# EAGLE schematic DasAltimeter square v0.1 (EAGLE 8.6.0)
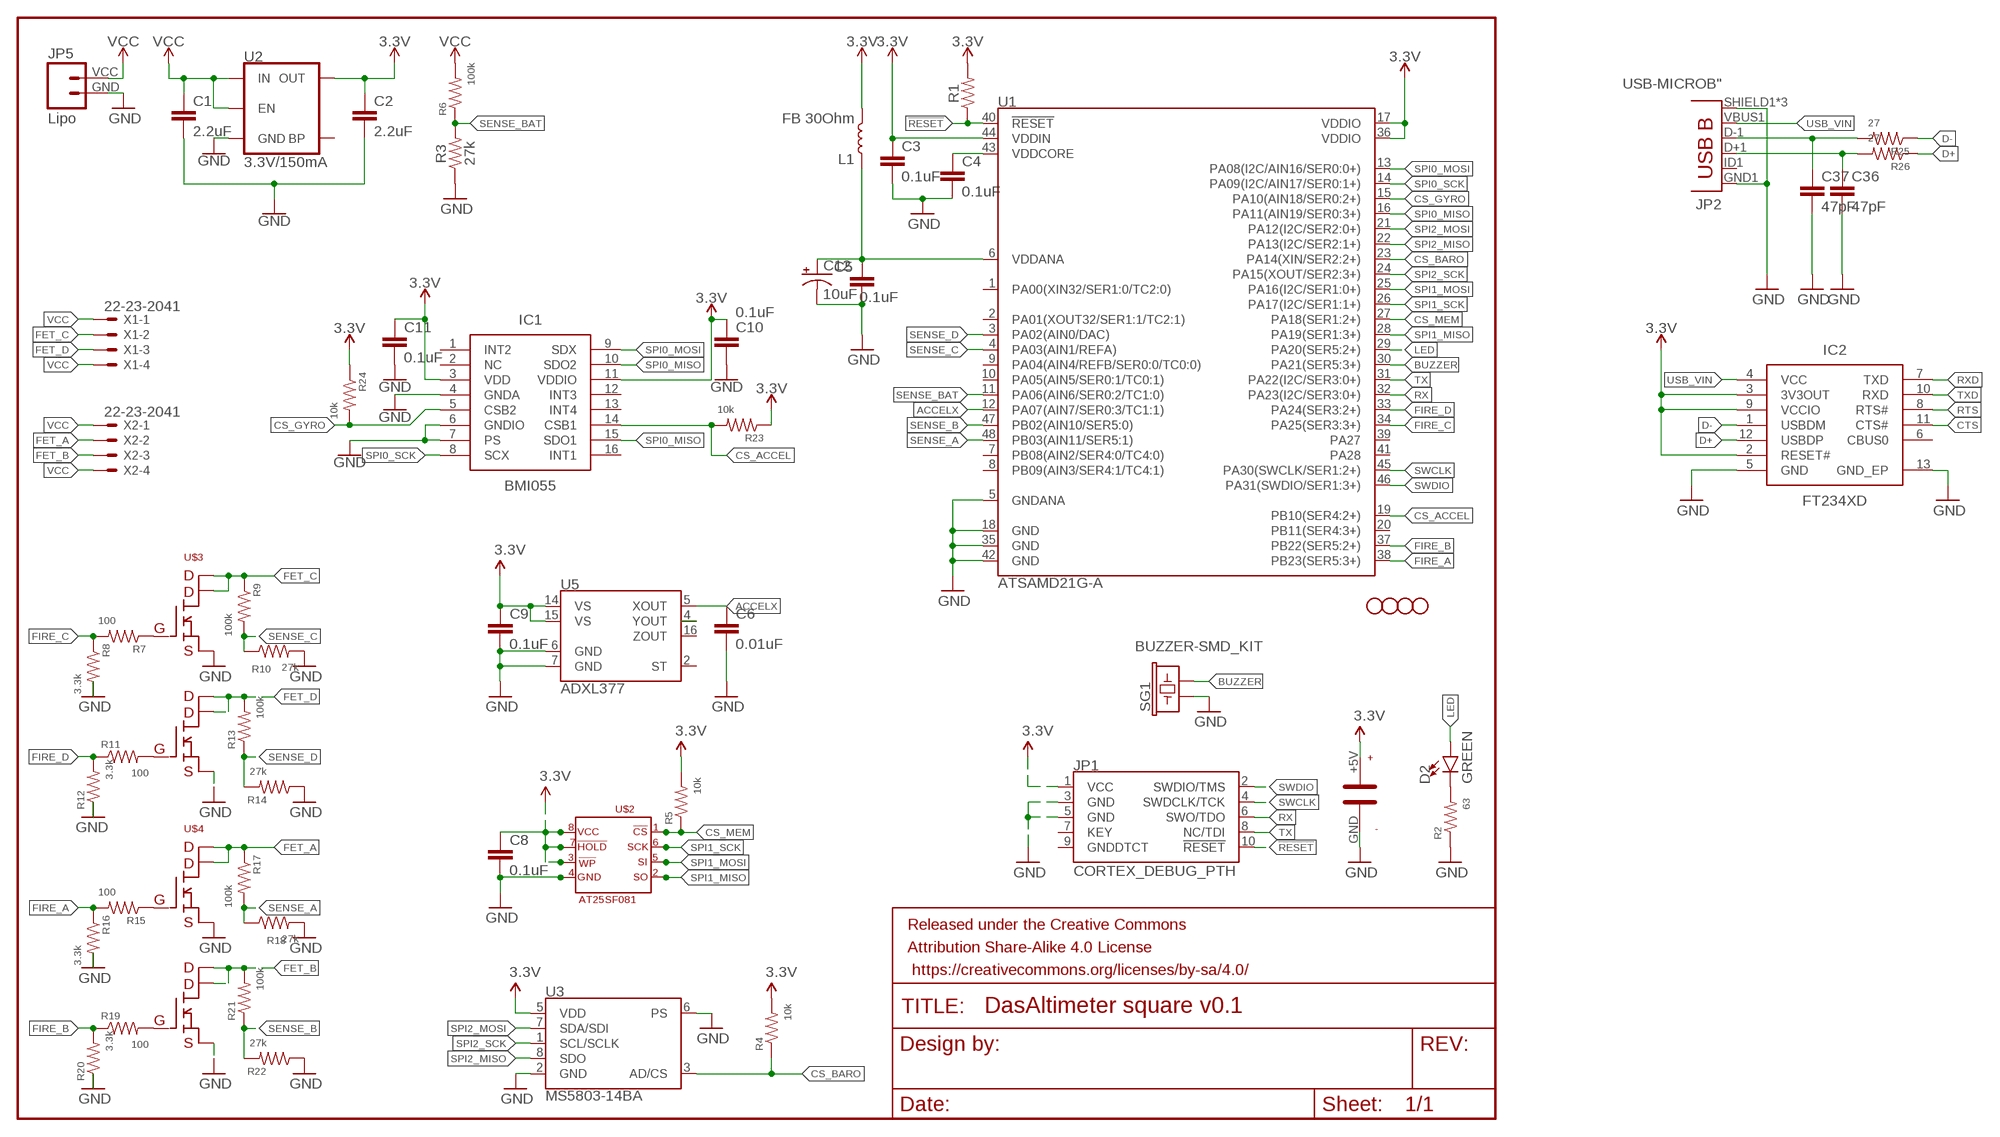
[diagram p0: schematic, sheet 1]

## Parts
C1  2.2uF  2.2UF-0603-10V-20%  [0603]
C2  2.2uF  2.2UF-0603-10V-20%  [0603]
C3  0.1uF  0.1UF-0402-16V-10%  [0402]
C4  0.1uF  0.1UF-0402-16V-10%  [0402]
C5  0.1uF  0.1UF-0402-16V-10%  [0402]
C6  0.01uF  0.1UF-0402-16V-10%  [0402]
C8  0.1uF  0.1UF-0402-16V-10%  [0402]
C9  0.1uF  0.1UF-0402-16V-10%  [0402]
C10  0.1uF  0.1UF-0402-16V-10%  [0402]
C11  0.1uF  0.1UF-0402-16V-10%  [0402]
C12  10uF  10UF-POLAR-0603-6.3V-20%(TANT)  [0603-POLAR]
C36  47pF  0.1UF-0402-16V-10%  [0402]
C37  47pF  0.1UF-0402-16V-10%  [0402]
D2  GREEN  LED-GREEN1206  [LED-1206]
FRAME1  FRAME-LETTERNO_PACKAGE  [DUMMY]
H1  STAND-OFFTIGHT  [STAND-OFF-TIGHT]
H2  STAND-OFFTIGHT  [STAND-OFF-TIGHT]
H3  STAND-OFFTIGHT  [STAND-OFF-TIGHT]
H4  STAND-OFFTIGHT  [STAND-OFF-TIGHT]
IC1  BMI055  [BMI055]
IC2  FT234XD  [SON45P300X300X80-13N]
JP1  CORTEX_DEBUG_PTH  [2X5-PTH-1.27MM]
JP2  USB-MICROB"  [USB-B-MICRO-SMD_V03]
JP5  Lipo  M024UCON-15767  [JST-2-SMD-VERT]
L1  FB 30Ohm  INDUCTOR-0603-33NH  [0603]
R1  RESISTOR0402  [0402]
R2  63  RESISTOR0402  [0402]
R3  27k  RESISTOR0402  [0402]
R4  10k  RESISTOR0402  [0402]
R5  10k  RESISTOR0402  [0402]
R6  100k  RESISTOR0402  [0402]
R7  100  RESISTOR0402  [0402]
R8  3.3k  RESISTOR0402  [0402]
R9  100k  RESISTOR0402  [0402]
R10  27k  RESISTOR0402  [0402]
R11  100  RESISTOR0402  [0402]
R12  3.3k  RESISTOR0402  [0402]
R13  100k  RESISTOR0402  [0402]
R14  27k  RESISTOR0402  [0402]
R15  100  RESISTOR0402  [0402]
R16  3.3k  RESISTOR0402  [0402]
R17  100k  RESISTOR0402  [0402]
R18  27k  RESISTOR0402  [0402]
R19  100  RESISTOR0402  [0402]
R20  3.3k  RESISTOR0402  [0402]
R21  100k  RESISTOR0402  [0402]
R22  27k  RESISTOR0402  [0402]
R23  10k  RESISTOR0402  [0402]
R24  10k  RESISTOR0402  [0402]
R25  27  RESISTOR0402  [0402]
R26  27  RESISTOR0402  [0402]
SG1  BUZZER-SMD_KIT  [BUZZER-CCV-KIT]
U1  ATSAMD21G-A  [TQFP-48]
U2  3.3V/150mA  V_REG_MIC52053.3V  [SOT23-5]
U3  MS5803-14BA  [MS5803]
U5  ADXL377  [LFCSP-16-3X3]
U$1  PB-5R0H104-R  [PB-5R0H104-R]
U$2  AT25SF081  [AT25SF081]
U$3  SI7232DN  [SI7232DN]
U$4  SI7232DN  [SI7232DN]
X1  22-23-2041  [22-23-2041]
X2  22-23-2041  [22-23-2041]

## Nets
3.3V: C2.1 C3.1 C8.1 C9.1 C10.1 C11.1 IC1.3(VDD) IC1.11(VDDIO) IC2.2(RESET#) IC2.3(3V3OUT) IC2.9(VCCIO) JP1.1(VCC) L1.2 R1.2 R4.2 R5.2 R23.1 R24.1 U1.17(VDDIO) U1.36(VDDIO) U1.44(VDDIN) U2.5(OUT) U3.5(VDD) U5.14(VS) U5.15(VS) U$1.+5V U$2.!HOLD U$2.!WP U$2.VCC
!RESET: JP1.10(!RESET) R1.1 U1.40(!RESET!)
ACCELX: C6.1 U1.12(PA07(AIN7/SER0:3/TC1:1)) U5.5(XOUT)
BUZZER: SG1.- U1.30(PA21(SER5:3+))
CS_ACCEL: IC1.14(CSB1) R23.2 U1.19(PB10(SER4:2+))
CS_BARO: R4.1 U1.23(PA14(XIN/SER2:2+)) U3.3(AD/CS)
CS_GYRO: IC1.5(CSB2) R24.2 U1.15(PA10(AIN18/SER0:2+))
CS_MEM: R5.1 U1.27(PA18(SER1:2+)) U$2.!CS
CTS: IC2.11(CTS#)
D+: IC2.12(USBDP) R26.1
D-: IC2.1(USBDM) R25.1
FET_A: R17.1 U$4.7(PIN7) U$4.8(PIN8) U$4.9(PIN8) X2.2
FET_B: R21.2 U$4.5(PIN5) U$4.6(PIN6) U$4.10(PIN5) X2.3
FET_C: R9.1 U$3.7(PIN7) U$3.8(PIN8) U$3.9(PIN8) X1.2
FET_D: R13.2 U$3.5(PIN5) U$3.6(PIN6) U$3.10(PIN5) X1.3
FIRE_A: R15.2 R16.1 U1.38(PB23(SER5:3+))
FIRE_B: R19.1 R20.2 U1.37(PB22(SER5:2+))
FIRE_C: R7.2 R8.1 U1.34(PA25(SER3:3+))
FIRE_D: R11.1 R12.2 U1.33(PA24(SER3:2+))
GND: C1.2 C2.2 C3.2 C4.2 C5.2 C6.2 C8.2 C9.2 C10.2 C11.2 C12.- C36.2 C37.2 IC1.4(GNDA) IC1.6(GNDIO) IC1.7(PS) IC2.5(GND) IC2.13(GND_EP) JP1.3(GND) JP1.5(GND) JP2.GND1(GND) JP2.SHIELD1(SHIELD) JP2.SHIELD2(SHIELD) JP2.SHIELD3(SHIELD) JP5.GND R2.1 R3.1 R8.2 R10.2 R12.1 R14.1 R16.2 R18.2 R20.1 R22.1 SG1.+ U1.5(GNDANA) U1.18(GND) U1.35(GND) U1.42(GND) U2.2(GND) U3.2(GND) U3.6(PS) U5.6(GND) U5.7(GND) U$1.GND U$2.GND U$3.1(PIN1) U$3.3(PIN3) U$4.1(PIN1) U$4.3(PIN3)
LED: D2.A U1.29(PA20(SER5:2+))
N$1: R7.1 U$3.2(PIN2)
N$2: U5.4(YOUT)
N$3: C4.1 U1.43(VDDCORE)
N$4: C5.1 C12.+ L1.1 U1.6(VDDANA)
N$5: C36.1 JP2.D+1(D+) R26.2
N$8: R11.2 U$3.4(PIN4)
N$12: R15.1 U$4.2(PIN2)
N$13: R19.2 U$4.4(PIN4)
N$17: C37.1 JP2.D-1(D-) R25.2
N$29: D2.C R2.2
RTS: IC2.8(RTS#)
RX: JP1.6(SWO/TDO) U1.32(PA23(I2C/SER3:0+))
RXD: IC2.7(TXD)
SENSE_A: R17.2 R18.1 U1.48(PB03(AIN11/SER5:1))
SENSE_B: R21.1 R22.2 U1.47(PB02(AIN10/SER5:0))
SENSE_BAT: R3.2 R6.1 U1.11(PA06(AIN6/SER0:2/TC1:0))
SENSE_C: R9.2 R10.1 U1.4(PA03(AIN1/REFA))
SENSE_D: R13.1 R14.2 U1.3(PA02(AIN0/DAC))
SPI0_MISO: IC1.10(SDO2) IC1.15(SDO1) U1.16(PA11(AIN19/SER0:3+))
SPI0_MOSI: IC1.9(SDX) U1.13(PA08(I2C/AIN16/SER0:0+))
SPI0_SCK: IC1.8(SCX) U1.14(PA09(I2C/AIN17/SER0:1+))
SPI1_MISO: U1.28(PA19(SER1:3+)) U$2.SO
SPI1_MOSI: U1.25(PA16(I2C/SER1:0+)) U$2.SI
SPI1_SCK: U1.26(PA17(I2C/SER1:1+)) U$2.SCK
SPI2_MISO: U1.22(PA13(I2C/SER2:1+)) U3.8(SDO)
SPI2_MOSI: U1.21(PA12(I2C/SER2:0+)) U3.7(SDA/SDI)
SPI2_SCK: U1.24(PA15(XOUT/SER2:3+)) U3.1(SCL/SCLK)
SWCLK: JP1.4(SWDCLK/TCK) U1.45(PA30(SWCLK/SER1:2+))
SWDIO: JP1.2(SWDIO/TMS) U1.46(PA31(SWDIO/SER1:3+))
TX: JP1.8(NC/TDI) U1.31(PA22(I2C/SER3:0+))
TXD: IC2.10(RXD)
USB_VIN: IC2.4(VCC) JP2.VBUS1(VBUS)
VCC: C1.1 JP5.VCC R6.2 U2.1(IN) U2.3(EN) X1.1 X1.4 X2.1 X2.4
Unconnected: IC1.1(INT2) IC1.2(NC) IC1.12(INT3) IC1.13(INT4) IC1.16(INT1) IC2.6(CBUS0) JP1.7(KEY) JP1.9(GNDDTCT) JP2.ID1(USBID) U1.1(PA00(XIN32/SER1:0/TC2:0)) U1.2(PA01(XOUT32/SER1:1/TC2:1)) U1.7(PB08(AIN2/SER4:0/TC4:0)) U1.8(PB09(AIN3/SER4:1/TC4:1)) U1.9(PA04(AIN4/REFB/SER0:0/TC0:0)) U1.10(PA05(AIN5/SER0:1/TC0:1)) U1.20(PB11(SER4:3+)) U1.39(PA27) U1.41(PA28) U2.4(BP) U5.2(ST) U5.16(ZOUT)

## Library data of the parts
C1 C2 = SparkFun-Capacitors:2.2UF: 2.2µF ceramic capacitors A capacitor is a passive two-terminal electrical component used to store electrical energy temporarily in an electric field.; PROD_ID: CAP-07888
C3-C5 C8-C11 = SparkFun-Capacitors:0.1UF: 0.1µF ceramic capacitors A capacitor is a passive two-terminal electrical component used to store electrical energy temporarily in an electric field.; PROD_ID: CAP-12416
C6 C36 C37 = SparkFun-Capacitors:0.1UF: 0.1µF ceramic capacitors A capacitor is a passive two-terminal electrical component used to store electrical energy temporarily in an electric field.; PROD_ID: CAP-12416; VALUE: 0.1uF
C12 = SparkFun-Capacitors:10UF-POLAR: 10.0µF polarized capacitors A capacitor is a passive two-terminal electrical component used to store electrical energy temporarily in an electric field.; PROD_ID: CAP-13210
D2 = SparkFun-LED:LED-GREEN: Green SMD LED Used in manufacturing of various products at SparkFun Packages: 0603 - SMD 0603 package [Product Link] <http://www.futureelectronics.com/en/technologies/semiconductors/optoelectronics/leds/Pages/9894312-LTST-C190GKT.aspx?CrossPart=HSMG-C190&IM=0> LilyPad 1206 - SMD1206 LilyPad package [Product Link] <http://www.futureelectronics.com/en/Technologies/Product.aspx?ProductID=IN150NGHARVATEKCORPORATION2049943&IM=0> 1206 - SMD1206 package [Product Link] <http://www.futureelectronics.com/en/technologies/semiconductors/optoelectronics/leds/Pages/8315665-LTST-C150KGKT.aspx?IM=0> 1206 Bottom Mount -SMD 1206 Bottom Mount [Product Link] <http://www.digikey.com/product-detail/en/lite-on-inc/LTST-C230KGKT/160-1456-1-ND/386854> SparkFun Products: Pro Mini 328 -5V <https://www.sparkfun.com/products/821> RedBoard <https://www.sparkfun.com/products/12757> MP3 Trigger <https://www.sparkfun.com/products/13720> Makey Makey <https://www.sparkfun.com/products/11076>; PROD_ID: DIO-00862
FRAME1 = SparkFun-Aesthetics:FRAME-LETTER: Schematic Frame - Letter Standard 8.5x11 US Letter frame; DESIGNER: Nobody; VERSION: v01
H1-H4 = SparkFun-Hardware:STAND-OFF: Stand Off Drill holes for mechanically mounting via screws, standoffs, etc. Note: Use the keepout ring to avoid running the screw head into surrounding components. Variant Overviews STAND-OFF - Mechanical footprint for a #4 phillips button head screw. STAND-OFF-TIGHT - Mechanical footprint for a #4 phillips button head screw, Example SparkFun Products Screw - Phillips Head (1/4", 4-40, 10 pack) <https://www.sparkfun.com/products/10453> (PRT-10453) Screw - Phillips Head (1/2", 4-40, 10 pack) <https://www.sparkfun.com/products/10452> (PRT-10452) Screw - Phillips Head (3/4", 4-40, 10 pack) <https://www.sparkfun.com/products/10451> (PRT-10451) Screw - Phillips Head (1", 4-40, 10 pack) <https://www.sparkfun.com/products/10450> (PRT-10450)
IC1 = BMI055:BMI055: IMUs - Inertial Measurement Units 6-Axis Inertia 3x4.5mm LGA-16 <https://componentsearchengine.com/Images/1/BMI055.jpg> Source: Datasheet <https://ae-bst.resource.bosch.com/media/_tech/media/datasheets/BST-BMI055-DS000-08.pdf>; DESCRIPTION: IMUs - Inertial Measurement Units 6-Axis Inertia 3x4.5mm LGA-16; HEIGHT: mm; MANUFACTURER_NAME: Bosch Sensortec; MANUFACTURER_PART_NUMBER: BMI055; SUPPLIER_NAME: RS
IC2 = ft234xd:FT234XD: USB to serial UART Source: Datasheet <http://www.ftdichip.com/Support/Documents/DataSheets/ICs/DS_FT234XD.pdf>; DESCRIPTION: USB to serial UART; HEIGHT: 0.8mm; MANUFACTURER_NAME: FTDI Chip; MANUFACTURER_PART_NUMBER: ft234xd; SUPPLIER_NAME: RS
JP1 = SparkFun-Connectors:CORTEX_DEBUG: Cortex Debug Connector - 10 pin Supports JTAG debug, Serial Wire debug, and Serial Wire Viewer. PTH and SMD connector options available. General Connector Information <http://infocenter.arm.com/help/topic/com.arm.doc.faqs/attached/13634/cortex_debug_connectors.pdf> Products: PTH Connector <http://www.digikey.com/product-detail/en/cnc-tech/3220-10-0100-00/1175-1627-ND/3883661> -via Digi-Key SparkFun PSoc <https://www.sparkfun.com/products/13229> SparkFun T <https://www.sparkfun.com/products/13810>
JP2 = SparkFun-Connectors:USB-MICROB; PROD_ID: CONN-11752
JP5 = SparkFun-Connectors:M02: Standard 2-pin 0.1" header. Use with - straight break away headers ( PRT-00116) - right angle break away headers (PRT-00553) - swiss pins (PRT-00743) - machine pins (PRT-00117) - female headers (PRT-00115) Molex polarized connector foot print use with: PRT-08233 with associated crimp pins and housings. 2.54_SCREWTERM for use with PRT-10571. 3.5mm Screw Terminal footprints for PRT-08084 5mm Screw Terminal footprints for use with PRT-08432
L1 = SparkFun-Coils:INDUCTOR: Inductors Resist changes in electrical current. Basically a coil of wire. SparkFun Products: SparkFun Load Cell Amplifier - HX711 <https://www.sparkfun.com/products/13879> IOIO-OTG - V2.2 <https://www.sparkfun.com/products/13613>; PROD_ID: NDUC-07874; VALUE: 33nH/±5%/500mA
R1-R26 = SparkFun-Resistors:RESISTOR: Generic Resistor Package
SG1 = SparkFun-Electromechanical:BUZZER: Buzzer Small round buzzers that operate around the audible 2kHz range. You can use these as speakers to create simple music or user interfaces. Variant Overview: PTH - Mini Speaker - PC Mount 12mm 2.048kHz <https://www.sparkfun.com/products/7950> PTH_KIT - Mini Speaker - PC Mount 12mm 2.048kHz <https://www.sparkfun.com/products/7950> KIT simplifies soldering by adding stop mask to one side of the pads. PTH_NO_SILK - Mini Speaker - PC Mount 12mm 2.048kHz <https://www.sparkfun.com/products/7950> No silkscreen indicator of buzzer outline. PTH_KIT_NO_SILK - Mini Speaker - PC Mount 12mm 2.048kHz <https://www.sparkfun.com/products/7950> KIT package w/o silkscreen SMD - Buzzer Audio Magnetic (CCV-084B16) SMD buzzer used on, e.g. the LilyPad Buzzer <https://www.sparkfun.com/products/8463> and RFID USB Reader <https://www.sparkfun.com/products/9963>. SMD_KIT - Buzzer Audio Magnetic (CCV-084B16) SMD Buzzer with elongated pins to make soldering easier. Used on the SparkFun Simon Says - Surface Mount Soldering Kit <https://www.sparkfun.com/products/10935>.; PROD_ID: COMP-08568
U1 = SparkFun-IC-Microcontroller:ATSAMD21G: Atmel SAMD21G SMART ARM-Based Microcontroller The Atmel ® | SMART ™ SAM D21 is a series of low-power microcontrollers using the 32-bit ARM ® Cortex ® -M0+ processor, and ranging from 32- to 64-pins with up to 256KB Flash and 32KB of SRAM. The SAM D21 devices operate at a maximum frequency of 48MHz and reach 2.46 CoreMark/MHz. They are designed for simple and intuitive migration with identical peripheral modules, hex compatible code, identical linear address map and pin compatible migration paths between all devices in the product series. All devices include intelligent and flexible peripherals, Atmel Event System for inter-peripheral signaling, and support for capacitive touch button, slider and wheel user interfaces. Datasheet <https://cdn.sparkfun.com/datasheets/Dev/Arduino/Boards/Atmel-42181-SAM-D21_Datasheet.pdf> SparkFun Products SparkFun SAMD21 Mini Breakout <https://www.sparkfun.com/products/13664> (DEV-13664) SparkFun SAMD21 Dev Breakout <https://www.sparkfun.com/products/13672> (DEV-13672); PROD_ID: IC-13064
U2 = SparkFun-IC-Power:V_REG_MIC5205: V_REG MIC5205 Standard 3.3V, 5V, and Adjustable 150mA LDO voltage regulator in SOT-23 layout. Micrel part MIC5205. BP (by-pass) pin is used to lower output noise with 470pF cap, may be left open. On the adjustable version BP is used to set output.; PROD_ID: VREG-00822
U3 = SparkFun-Sensors:MS5803-14BA: Measurement Specialties MS5803_14BA Pressure (Depth) Sensor The MS5803-14BA is a new generation of high resolution pressure sensors with SPI and I2C bus interface. It is optimized for depth measurement systems with a water depth resolution of 1cm and below. The sensor module includes a high linear pressure sensor and an ultra low power 24 bit ΔΣ ADC with internal factory calibrated coefficients. It provides a precise digital 24 Bit pressure and temperature value and different operation modes that allow the user to optimize for conversion speed and current consumption. Datasheet <https://cdn.sparkfun.com/datasheets/Sensors/Weather/ms5803_14ba.pdf> SparkFun Products SparkFun Pressure Sensor Breakout - MS5803-14BA <https://www.sparkfun.com/products/12909> (SEN-12909); PROD_ID: IC-12111
U5 = SparkFun-Sensors:ADXL377: Analog Devices ADXL377 Low Power 3-Axis ±200 g Accelerometer with Analog Output The ADXL377 is a small, thin, low power, complete 3-axis accelerometer with signal conditioned voltage outputs. The ADXL377 measures acceleration resulting from motion, shock, or vibration with a typical full-scale range of ±200g. Datasheet <https://cdn.sparkfun.com/datasheets/Sensors/Accelerometers/ADXL377.pdf> SparkFun Products SparkFun Triple Axis Accelerometer Breakout - ADXL377 <https://www.sparkfun.com/products/12803> (SEN-12803); PROD_ID: IC-12027
U$1 = SaL-lib1:PB-5R0H104-R
U$2 = SaL-lib1:AT25SF081: AT25SF081 - 8M memory smd
U$3 U$4 = SaL-lib1:SI7232DN: SI7232DN dual
X1 X2 = con-molex:22-23-2041: .100" (2.54mm) Center Header - 4 Pin; MF: MOLEX; MPN: 22-23-2041; OC_FARNELL: 1462920; OC_NEWARK: 38C0355